# EAGLE design fun_shield_v11 (EAGLE 6.3)
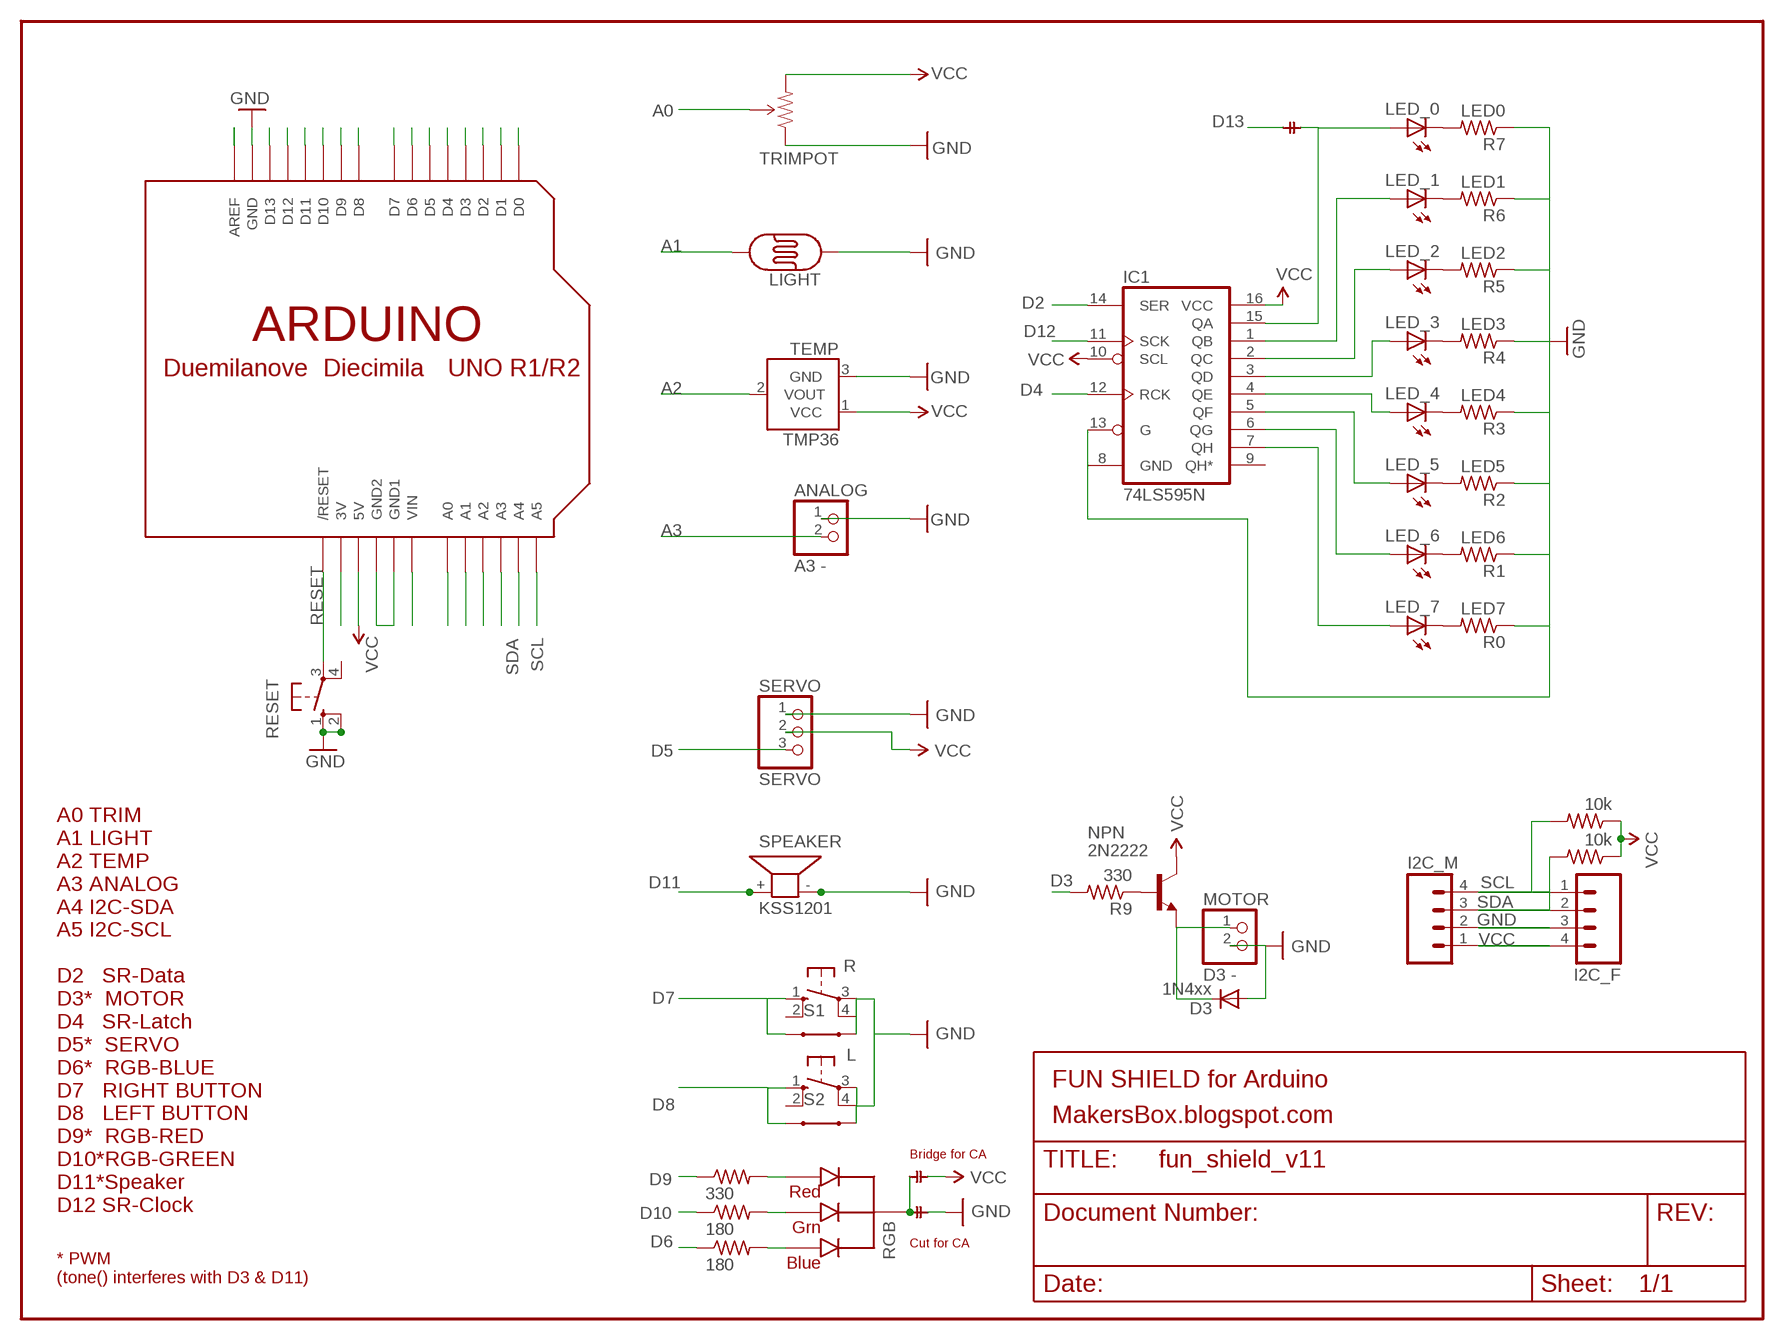
[diagram p0: schematic, sheet 1]

## Parts
ANALOG  A3 -  PINHD-1X2  [1X02]
D3  1N4xx  DIODE1N4148  [DIODE-1N4148]
I2C_F  M04PTH  [1X04]
I2C_M  M04PTH  [1X04]
IC1  74LS595N  [DIL16]
L  10-XX  [B3F-10XX]
LED_0  LED5MM  [LED5MM]
LED_1  LED5MM  [LED5MM]
LED_2  LED5MM  [LED5MM]
LED_3  LED5MM  [LED5MM]
LED_4  LED5MM  [LED5MM]
LED_5  LED5MM  [LED5MM]
LED_6  LED5MM  [LED5MM]
LED_7  LED5MM  [LED5MM]
LIGHT  PHOTOCELLPTH  [PHOTOCELL]
MOTOR  D3 -  PINHD-1X2  [1X02]
NPN  2N2222  [TO92-EBC-OVAL]
R  10-XX  [B3F-10XX]
R0  LED7  R-US_0204/7  [0204/7]
R1  LED6  R-US_0204/7  [0204/7]
R2  LED5  R-US_0204/7  [0204/7]
R3  LED4  R-US_0204/7  [0204/7]
R4  LED3  R-US_0204/7  [0204/7]
R5  LED2  R-US_0204/7  [0204/7]
R6  LED1  R-US_0204/7  [0204/7]
R7  LED0  R-US_0204/7  [0204/7]
R8  330  R-US_0204/7  [0204/7]
R9  330  R-US_0204/7  [0204/7]
R11  180  R-US_0204/7  [0204/7]
R12  180  R-US_0204/7  [0204/7]
R16  10k  R-US_0204/7  [0204/7]
R17  10k  R-US_0204/7  [0204/7]
RESET  10-XX  [B3F-10XX]
RGB  RGBLED_CC  [LED5MMRGB]
S1  SWITCH-MOMENTARY-2-CLOSED  [TACTILE-PTH-12MM]
S2  SWITCH-MOMENTARY-2-CLOSED  [TACTILE-PTH-12MM]
SERVO  SERVO  PINHD-1X3  [1X03]
SP1  KSS1201  [KSS1201]
SPEAKER  SPEAKER/PS12  [PS12]
TMP36  TEMP  TMP36  [TO-92-AMMO]
TRIMPOT  TRIMPOT  [3362U]
U$1  CUT  [CUT]
U$2  CUT_NOT  [CUT_NOT]
U$3  CUT_NOT  [CUT_NOT]
U$5  ARDUINO-NOHOLE  [ARDUINO-NOHOLE]

## Nets
A0: TRIMPOT.P$2(WIPER) TRIMPOT.P$4(WIPER) U$5.A0
A1: LIGHT.2 U$5.A1
A2: TMP36.2(VOUT) U$5.A2
A3: ANALOG.2 U$5.A3
BLUE: R12.2 RGB.4(BLUE)
D0: U$5.D0
D1: U$5.D1
D2: IC1.14(SER) U$5.D2
D3: R9.2 U$5.D3
D4: IC1.12(RCK) U$5.D4
D5: SERVO.3 U$5.D5
D6: R12.1 U$5.D6
D7: R.1(S) S1.1 U$5.D7
D8: L.1(S) S2.1 U$5.D8
D9: R8.1 U$5.D9
D10: R11.1 U$5.D10
D11: SP1.+ SPEAKER.P$1(+) U$5.D11
D12: IC1.11(SCK) U$5.D12
D13: IC1.15(QA) LED_0.A U$3.P$1 U$3.P$2 U$5.D13
GND [power]: ANALOG.1 D3.A I2C_F.3 I2C_M.2 IC1.8(GND) IC1.13(G) L.3(P) L.4(P1) LIGHT.1 MOTOR.2 R0.1 R1.1 R2.1 R3.1 R4.1 R5.1 R6.1 R7.1 R.3(P) R.4(P1) RESET.1(S) RESET.2(S1) S1.3 S2.3 SERVO.1 SP1.- SPEAKER.P$2(-) TMP36.3(GND) TRIMPOT.P$1(CCW) U$2.P$2 U$5.GND U$5.GND1 U$5.GND2
GRN: R11.2 RGB.3(GREEN)
N$1: LED_6.K(C) R1.2
N$2: LED_5.K(C) R2.2
N$3: LED_4.K(C) R3.2
N$4: LED_3.K(C) R4.2
N$5: LED_2.K(C) R5.2
N$6: LED_1.K(C) R6.2
N$7: LED_0.K(C) R7.2
N$8: LED_7.K(C) R0.2
N$10: IC1.1(QB) LED_1.A
N$11: IC1.2(QC) LED_2.A
N$12: IC1.3(QD) LED_3.A
N$13: IC1.4(QE) LED_4.A
N$14: IC1.5(QF) LED_5.A
N$15: IC1.6(QG) LED_6.A
N$16: IC1.7(QH) LED_7.A
N$17: U$5.3V
N$20: D3.C MOTOR.1 NPN.E
N$21: RGB.2(GND) U$1.P$1 U$2.P$1
N$22: NPN.B R9.1
RED: R8.2 RGB.1(RED)
RESET: RESET.3(P) U$5.RESET(/RESET)
SCL: I2C_F.1 I2C_M.4 R17.2 U$5.A5
SDA: I2C_F.2 I2C_M.3 R16.2 U$5.A4
VCC: I2C_F.4 I2C_M.1 IC1.10(SCL) IC1.16(VCC) NPN.C R16.1 R17.1 SERVO.2 TMP36.1(VCC) TRIMPOT.P$3(CW) U$1.P$2 U$5.5V U$5.AREF
VIN: U$5.VIN
Unconnected: IC1.9(QH*) L.2(S1) R.2(S1) RESET.4(P1)

## Notes on the sheet
- FUN SHIELD for Arduino
- MakersBox.blogspot.com
- Bridge for CA
- A0 TRIM
  A1 LIGHT
  A2 TEMP
  A3 ANALOG
  A4 I2C-SDA
  A5 I2C-SCL
  
  D2   SR-Data
  D3*  MOTOR
  D4   SR-Latch
  D5*  SERVO
  D6*  RGB-BLUE
  D7   RIGHT BUTTON
  D8   LEFT BUTTON
  D9*  RGB-RED
  D10*RGB-GREEN
  D11*Speaker
  D12 SR-Clock
- Cut for CA
- * PWM
  (tone() interferes with D3 & D11)

## Library data of the parts
ANALOG MOTOR = pinhead:PINHD-1X2: PIN HEADER
D3 = SparkFun_mod:DIODE: Diode These are standard reverse protection diodes and small signal diodes. SMA package can handle up to about 1A. SOD-323 can handle about 200mA. What the SOD-323 package when ordering, there are some mfgs out there that are 5-pin packages.
I2C_F I2C_M = SparkFun:M04: Header 4 Standard 4-pin 0.1" header. Use with straight break away headers (SKU : PRT-00116), right angle break away headers (PRT-00553), swiss pins (PRT-00743), machine pins (PRT-00117), and female headers (PRT-00115). Molex polarized connector foot print use with SKU : PRT-08231 with associated crimp pins and housings. 1MM SMD Version SKU: PRT-10208
IC1 = SparkFun_mod:74*595: 8-bit SHIFT REGISTER, output latch
L R RESET = switch-omron:10-XX: OMRON SWITCH
LED_0 LED_1-LED_7 = adafruit_mod:LED: LED OSRAM: - CHIPLED LG R971, LG N971, LY N971, LG Q971, LY Q971, LO R971, LY R971 LH N974, LH R974 LS Q976, LO Q976, LY Q976 LO Q996 - Hyper CHIPLED LW Q18S LB Q993, LB Q99A, LB R99A - SideLED LS A670, LO A670, LY A670, LG A670, LP A670 LB A673, LV A673, LT A673, LW A673 LH A674 LY A675 LS A676, LA A676, LO A676, LY A676, LW A676 LS A679, LY A679, LG A679 - Hyper Micro SIDELED® LS Y876, LA Y876, LO Y876, LY Y876 LT Y87S - SmartLED LW L88C, LW L88S LB L89C, LB L89S, LG L890 LS L89K, LO L89K, LY L89K LS L896, LA L896, LO L896, LY L896 - TOPLED LS T670, LO T670, LY T670, LG T670, LP T670 LSG T670, LSP T670, LSY T670, LOP T670, LYG T670 LG T671, LOG T671, LSG T671 LB T673, LV T673, LT T673, LW T673 LH T674 LS T676, LA T676, LO T676, LY T676, LB T676, LH T676, LSB T676, LW T676 LB T67C, LV T67C, LT T67C, LS T67K, LO T67K, LY T67K, LW E67C LS E67B, LA E67B, LO E67B, LY E67B, LB E67C, LV E67C, LT E67C LW T67C LS T679, LY T679, LG T679 LS T770, LO T770, LY T770, LG T770, LP T770 LB T773, LV T773, LT T773, LW T773 LH T774 LS E675, LA E675, LY E675, LS T675 LS T776, LA T776, LO T776, LY T776, LB T776 LHGB T686 LT T68C, LB T68C - Hyper Mini TOPLED® LB M676 - Mini TOPLED Santana® LG M470 LS M47K, LO M47K, LY M47K Source: http://www.osram.convergy.de/
LIGHT = SparkFun_mod:PHOTOCELL: Photocell Also known as a CdS photoresistor. This is a low cost way to detect light levels. Resistance decreases with more incoming light. SparkFun SKU: SEN-09088
NPN = adafruit_mod:2N2222: NPN TRANSISTOR Big oval pads
R0 R1-R9 R11 R12 R16 R17 = adafruit_mod:R-US_: RESISTOR, American symbol
RGB = adafruit_mod:RGBLED_CC
S1 S2 = SparkFun-Electromechanical:SWITCH-MOMENTARY-2-CLOSED: Closed Switch for tutorial schematics. Not intended for PCB design. Maps to 12mm tact switch, only because eagle won't place a part with no package defined. The ordinary SWITCH-MOMENTARY-2 is likely to be more useful for regular schematics.
SERVO = pinhead:PINHD-1X3: PIN HEADER
SP1 = buzzer:KSS1201: SPEAKER Source: Schukat; OC_FARNELL: unknown; OC_NEWARK: unknown
SPEAKER = adafruit_mod:SPEAKER: SPEAKER Source: Buerklin Added PS12 (for part # PS1240 piezo) http://www.ladyada.net/library/pcb/eaglelibrary.html
TMP36 = SparkFun_mod:TMP36
TRIMPOT = SparkFun_mod:TRIMPOT
U$1 = _my-parts_level22:CUT
U$2 U$3 = _my-parts_level22:CUT_NOT
U$5 = adafruit_mod:ARDUINO: Arduino Diecimila/Duemilanove Make a shield with ease, this package has all the named pins as well as the two mounting drill holes and an outline of the USB and DC power connector. The outline is on the DIMENSION layer, so if your board house uses it they will cut the outline to match. http://www.ladyada.net/library/pcb/eaglelibrary.html

## Net classes
1 power: width 0.61 mm

## Board
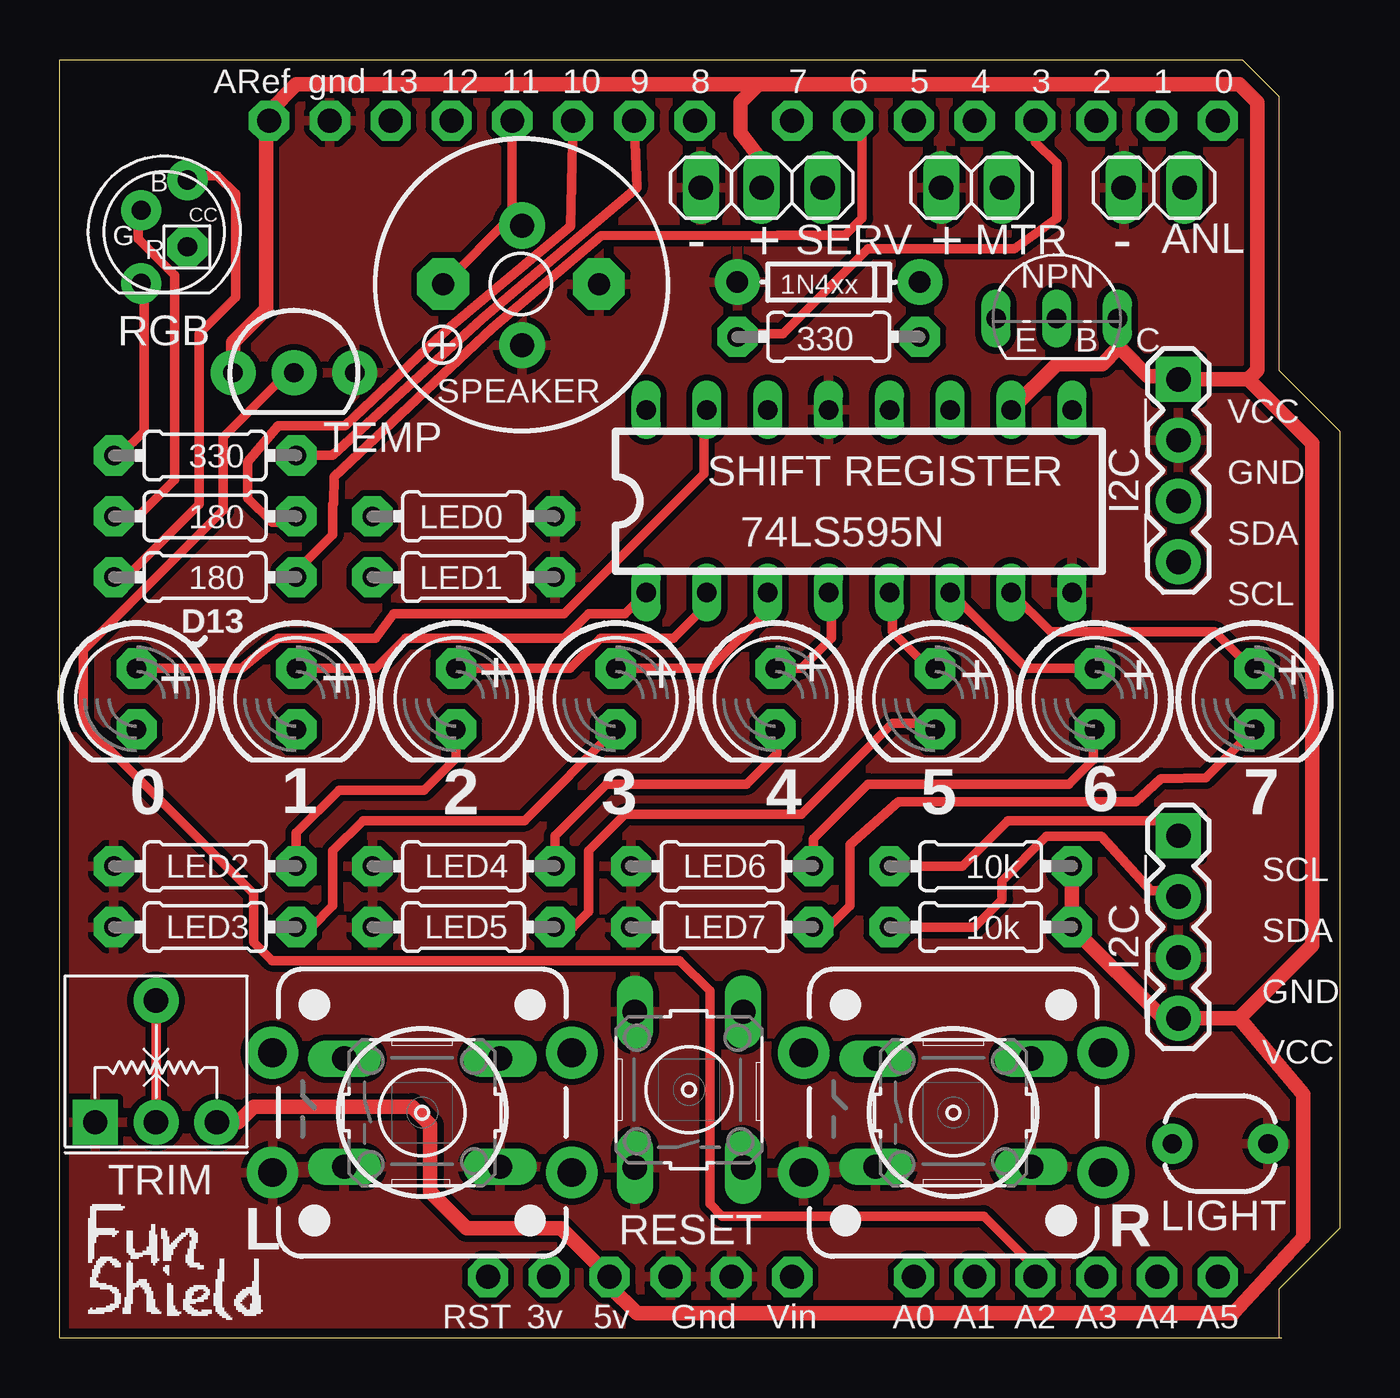
[diagram p1: board, top side]
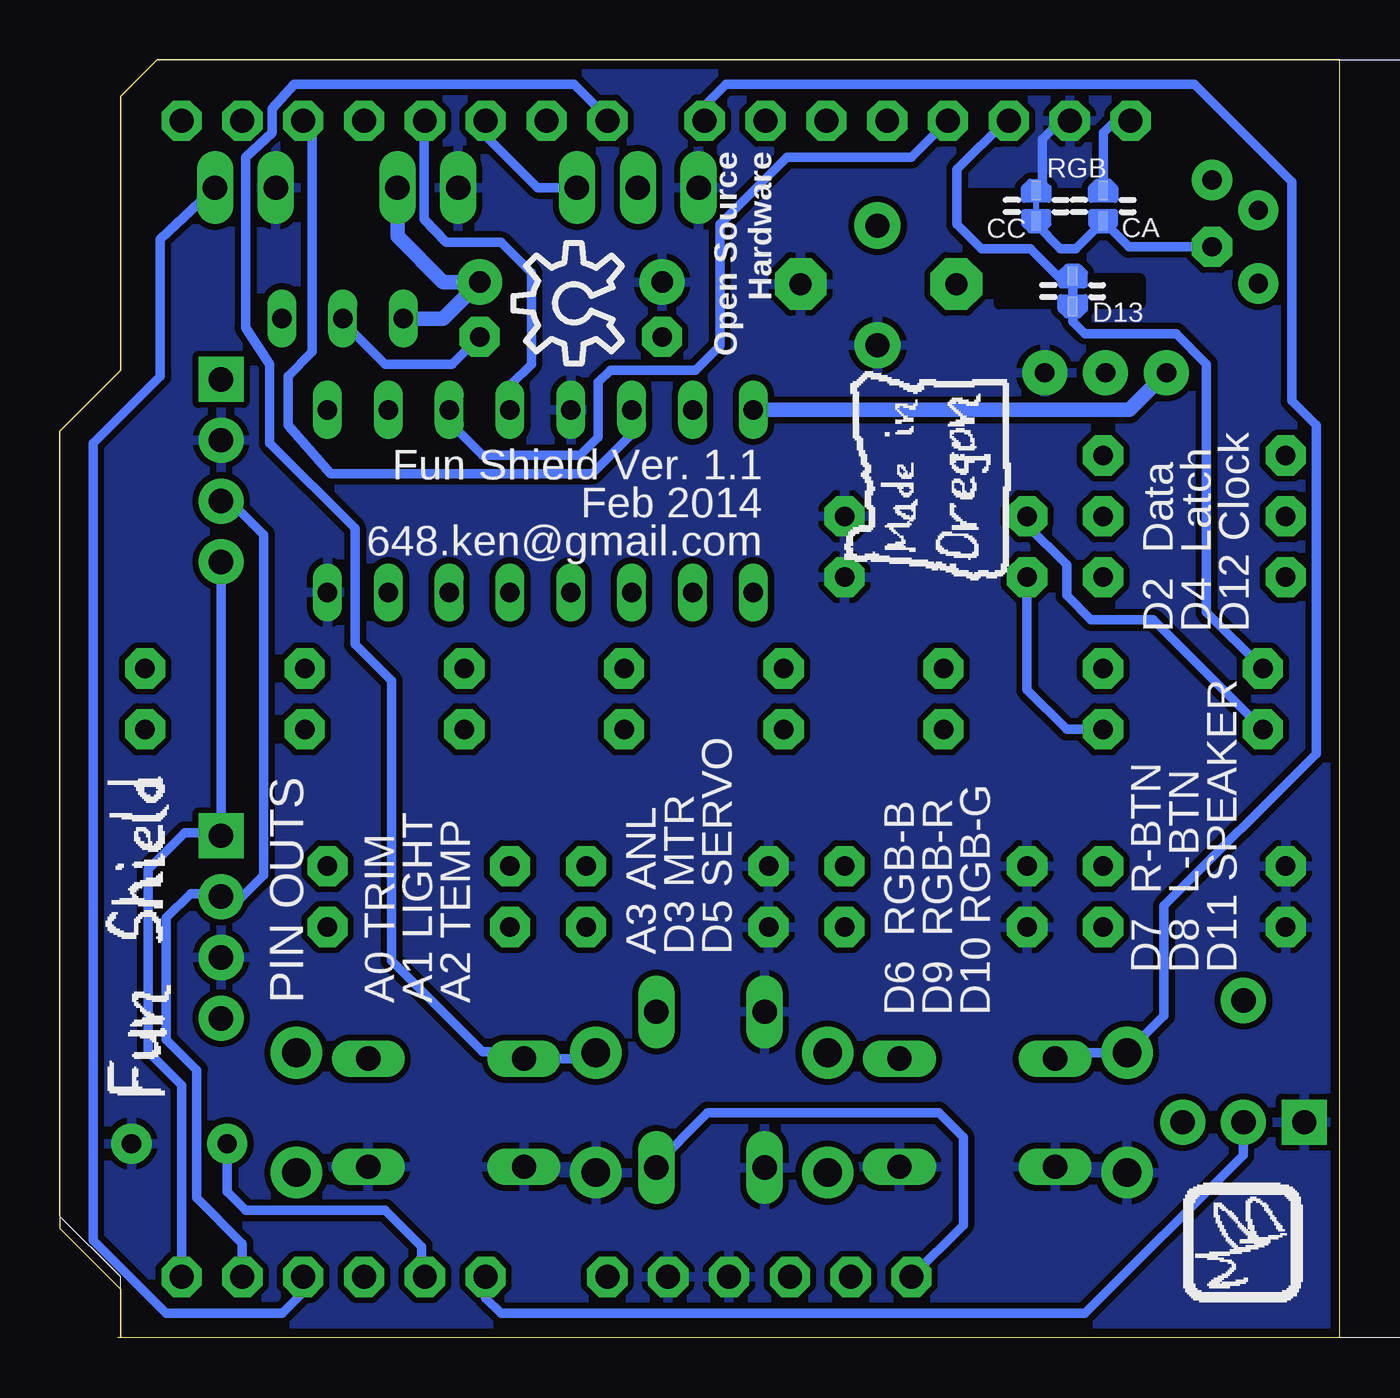
[diagram p2: board, bottom side, seen from below]

Size 53.44 x 53.34 mm. Coordinates in mm from the lower left corner, seen from the top.
Outline: 50.9,0 50.9,2.03 53.44,4.57 53.44,37.85 50.9,40.39 50.9,51.82 49.37,53.34 0,53.34 0,0 51.02,0
Copper layers (1*16): Top 0.0356mm / dielectric 1.5011mm / Bottom 0.0356mm
Design rules "LaenPCBOrder": minimum track width 6mil, minimum drill 13mil, track to track 6mil, track to pad 6mil, pad to pad 6mil, via to via 6mil, smd to smd 6mil, copper to edge 15mil, drill to drill 6mil, minimum pad ring 7mil, minimum via ring 7mil, stop-mask expansion 4mil, vias tented up to drill 0mil, thermal gap 10mil

### Footprints (pad centres in the part's own frame; a part is rotated, then mirrored left to right if it is on the bottom)
1X02 = drill 1.016 long: 1 -1.27,0; 2 1.27,0
DIODE-1N4148 = drill 0.9 pad 1.88: A -3.81,0; C 3.81,0
1X04 = drill 1.016 pad 1.88 square: 1 0,0 | drill 1.016 pad 1.88: 2 2.54,0; 3 5.08,0; 4 7.62,0
DIL16 = drill 0.813 long: 1 -8.89,-3.81; 2 -6.35,-3.81; 3 -3.81,-3.81; 4 -1.27,-3.81; 5 1.27,-3.81; 6 3.81,-3.81; 7 6.35,-3.81; 8 8.89,-3.81; 9 8.89,3.81; 10 6.35,3.81; 11 3.81,3.81; 12 1.27,3.81; 13 -1.27,3.81; 14 -3.81,3.81; 15 -6.35,3.81; 16 -8.89,3.81
B3F-10XX = drill 1.016 long: 1 -3.251,2.261; 2 3.251,2.261; 3 -3.251,-2.261; 4 3.251,-2.261
LED5MM = drill 0.813 pad 1.676 octagon: A -1.27,0; K 1.27,0
PHOTOCELL = drill 0.8 pad 1.676: 1 -2,0; 2 2,0
TO92-EBC-OVAL = drill 0.813 long: B 0,-1.27; C 2.54,-1.27; E -2.54,-1.27
0204/7 = drill 0.813 pad 1.676 octagon: 1 -3.81,0; 2 3.81,0
LED5MMRGB = drill 0.8 pad 1.676: 1 -2.159,0.968; 3 0.889,0.968; 4 2.159,-0.968 | drill 0.8 pad 1.676 octagon: 2 -0.635,-0.968
TACTILE-PTH-12MM = drill 1.2 pad 2.159: 1 6.25,-2.5; 2 -6.25,-2.5; 3 6.25,2.5; 4 -6.25,2.5
1X03 = drill 1.016 long: 1 -2.54,0; 2 0,0; 3 2.54,0
KSS1201 = drill 0.914 pad 2.159 octagon: + 3.251,0; - -3.251,0
PS12 = drill 1 pad 1.93: P$1 -2.5,0; P$2 2.5,0
TO-92-AMMO = drill 0.813 pad 1.88: 1 -2.54,0; 2 0,0; 3 2.54,0
3362U = drill 1.016 pad 1.88 square: P$1 0,0 | drill 1.016 pad 1.88: P$2 2.54,0; P$3 5.08,0; P$4 2.54,5.08
CUT = smd 0.813 x 0.406 bottom: P$1 -0.635,0; P$2 0.635,0
CUT_NOT = smd 0.813 x 0.406 bottom: P$1 -0.635,0; P$2 0.635,0
ARDUINO-NOHOLE = drill 1 pad 1.676 octagon: 3V 35.56,2.54; 5V 38.1,2.54; A0 50.8,2.54; A1 53.34,2.54; A2 55.88,2.54; A3 58.42,2.54; A4 60.96,2.54; A5 63.5,2.54; AREF 23.876,50.8; D0 63.5,50.8; D1 60.96,50.8; D2 58.42,50.8; D3 55.88,50.8; D4 53.34,50.8; D5 50.8,50.8; D6 48.26,50.8; D7 45.72,50.8; D8 41.656,50.8; D9 39.116,50.8; D10 36.576,50.8; D11 34.036,50.8; D12 31.496,50.8; D13 28.956,50.8; GND 26.416,50.8; GND1 43.18,2.54; GND2 40.64,2.54; RESET 33.02,2.54; VIN 45.72,2.54

### Placement (x,y rotation side)
ANALOG  45.69,48.01 0 top
D3  32.1,44.07 0 top
I2C_F  46.7,20.95 270 top
I2C_M  46.7,40.01 270 top
IC1  33.37,34.92 0 top
L  15.13,9.4 0 top
LED_0  3.21,26.67 270 top
LED_1  9.87,26.67 270 top
LED_2  16.54,26.67 270 top
LED_3  23.21,26.67 270 top
LED_4  29.88,26.67 270 top
LED_5  36.54,26.67 270 top
LED_6  43.21,26.67 270 top
LED_7  49.88,26.67 270 top
LIGHT  48.45,8.11 180 top
MOTOR  38.07,48.01 180 top
NPN  41.62,43.81 0 top
R  37.31,9.4 0 top
R0  27.65,17.14 0 top
R1  27.65,19.68 0 top
R2  16.86,17.14 0 top
R3  16.86,19.68 0 top
R4  6.06,17.14 0 top
R5  6.06,19.68 0 top
R6  16.86,31.75 180 top
R7  16.86,34.29 180 top
R8  6.06,36.83 180 top
R9  32.1,41.78 180 top
R11  6.06,34.29 180 top
R12  6.06,31.75 180 top
R16  38.45,17.14 180 top
R17  38.45,19.68 180 top
RESET  26.27,10.36 90 top
RGB  4.36,46.17 90 top
S1  37.31,9.4 180 top
S2  15.13,9.4 180 top
SERVO  29.31,48.01 0 top
SP1  19.25,43.98 180 top
SPEAKER  19.29,43.92 270 top
TMP36  9.77,40.28 0 top
TRIMPOT  1.47,9 0 top
U$1  9.87,47.24 90 top
U$2  12.67,47.24 90 top
U$3  11.14,43.69 270 top
U$4  [FUN_SHEILD_22]  49.96,8.99 270 top
U$5  -15.14,0 0 top
U$6  [MB_02_22]  1.75,6.18 270 top
U$7  [OREGON_REV_035]  13.68,40.39 270 top
U$8  [FUN_SHIELD_03_300]  1.14,0.71 0 top
U$9  [OSHWLOGO_BOTTOM]  31.97,43.18 270 top

### Tracks (layer width: path | path; a pad name or v marks a point on that pad's centre or on a via)
A0
  Bottom 0.406: U$5.A0 35.66,1.65 35.02,1.02 10.64,1.02 4.03,7.62 4.03,8.98 TRIMPOT.P$2
A1
  Bottom 0.406: LIGHT.2 46.44,6.09 45.69,5.33 39.85,5.33 38.32,3.81 38.32,2.67 U$5.A1
A2
  Top 0.406: TMP36.2 9.52,40.28 6.83,37.59 6.83,34.54 0.98,28.7 0.98,25.65 8.1,18.54 8.1,16.51 8.86,15.75 25.88,15.75 27.15,14.48 27.15,5.59 27.65,5.08 38.58,5.08 40.61,3.05 40.61,2.67 U$5.A2
A3
  Bottom 0.406: U$5.A3 43.28,1.91 44.16,1.02 48.99,1.02 52.04,4.06 52.04,37.34 49.24,40.13 49.24,45.85 ANALOG.2
BLUE
  Top 0.406: R12.2 2.76,31.75 5.81,34.8 5.81,41.91 7.33,43.43 7.33,47.75 6.57,48.51 5.51,48.51 RGB.4
D2
  Bottom 0.406: IC1.14 29.56,37.72 31.21,36.07 42.13,36.07 43.91,38.1 43.91,40.13 42.89,41.15 42.89,50.42 U$5.D2
D3
  Top 0.406: U$5.D3 40.73,49.91 41.62,49.02 41.62,46.74 39.85,45.47 33.75,45.47 30.19,41.91 28.42,41.91 R9.2
D4
  Bottom 0.406: IC1.12 34.64,39.75 33.75,40.64 33.75,44.45 35.02,45.72 37.31,45.72 38.22,46.69 38.22,50.62 U$5.D4
D5
  Bottom 0.406: U$5.D5 35.66,50.16 33.5,48.01 SERVO.3
D6
  Top 0.406: R12.1 9.87,32 11.4,33.53 11.4,34.8 11.42,34.82 11.45,35.94 18.05,42.14 22.6,46 29.96,46.02 32.78,46.02 33.5,46.74 33.5,50.42 U$5.D6
D7
  Bottom 0.406: U$5.D7 30.57,50.93 31.97,52.32 43.66,52.32 44.57,51.31 44.57,50.29 45.69,49.28 45.69,42.16 44.67,40.64 44.67,37.34 41.12,33.78 41.12,28.96 39.59,27.43 39.59,15.75 35.78,11.94 34.33,11.94 R.1 31.29,11.66 S1.1
D8
  Bottom 0.406: U$5.D8 26.51,51.44 25.62,52.32 6.06,52.32 2,48.26 2,39.12 0.98,38.1 0.98,24.38 7.33,18.03 7.33,13.44 S2.1 11.64,11.9 L.1
D9
  Top 0.406: U$5.D9 24.1,48.01 17.62,42.55 11.4,36.83 R8.1
D10
  Top 0.406: U$5.D10 21.33,46.41 16.35,42.24 15.72,41.66 11.91,38.08 9.11,38.08 7.84,36.58 7.84,35.05 8.86,34.04 9.62,34.04 R11.1
D11
  Top 0.406: U$5.D11 18.89,46.83 | 18.89,46.83 SPEAKER.P$1 | SP1.+ 16.05,43.98 18.89,46.83
D12
  Bottom 0.406: IC1.11 37.18,38.23 35.78,36.83 31.72,36.83 30.96,37.59 30.96,39.88 30.45,40.39 26.89,40.39 25.88,41.4 25.88,46.48 23.08,49.28 17.88,49.28 U$5.D12
D13
  Top 0.406: LED_0.A 7.59,27.94 9.11,29.21 13.18,29.21 13.94,30.23 21.05,30.23 26.89,36.07 26.89,38.61 IC1.15
  Bottom 0.406: U$5.D13 13.94,50.8 15.97,48.77 15.97,46.48 14.95,45.47 12.92,45.47 11.65,44.2 11.27,44.2 U$3.P$1 U$3.P$2 11.14,42.42 10.64,41.91 6.83,41.91 5.56,40.64 5.56,30.29 LED_0.A
GND
  Bottom 0.406: U$5.GND 11.65,50.8 12.41,50.04 12.41,48.13 U$2.P$2
  pour Bottom (isolate 0.254): -17.68,58.42 57.88,57.78 57.88,-3.05 -17.68,-3.81
  pour Top (isolate 0.254): -18.95,57.15 60.17,56.9 59.91,-4.83 -17.68,-4.83
GRN
  Top 0.406: R11.2 3.27,34.29 4.79,35.81 4.79,44.35 3.27,45.87 3.27,46.94 RGB.3
N$1
  Top 0.406: R1.2 31.46,20.83 33.75,23.11 42.13,23.11 43.15,24.13 43.15,25.34 LED_6.K
N$2
  Top 0.406: R2.2 21.43,17.14 22.07,17.78 22.07,20.32 23.59,21.84 30.96,21.84 34.77,25.65 36.29,25.65 LED_5.K
N$3
  Top 0.406: R3.2 20.67,20.95 22.83,23.11 28.67,23.11 29.94,24.38 29.94,25.34 LED_4.K
N$4
  Top 0.406: R4.2 10.51,17.14 11.4,18.03 11.4,20.32 12.67,21.59 19.4,21.59 LED_3.K
N$5
  Top 0.406: LED_2.K 16.54,24.19 15.21,22.86 11.65,22.86 9.87,21.08 R5.2
N$6
  Bottom 0.406: R6.2 13.05,27.05 11.4,25.4 LED_1.K
N$7
  Bottom 0.406: R7.2 13.05,33.91 11.4,32.26 11.4,30.99 10.38,29.97 7.78,29.97 LED_0.K
N$8
  Top 0.406: R0.2 32.1,17.14 32.99,18.03 32.99,20.57 35.02,22.38 44.93,22.38 45.97,23.34 47.85,23.37 LED_7.K
N$10
  Top 0.406: LED_1.A 13.18,27.94 14.45,29.21 21.05,29.21 22.07,30.23 23.59,30.23 IC1.1
N$11
  Top 0.406: LED_2.A 21.3,27.94 22.57,29.21 25.62,29.21 26.89,30.48 26.89,30.99 IC1.2
N$12
  Top 0.406: LED_3.A 27.15,27.94 29.69,30.48 29.69,30.99 IC1.3
N$13
  Top 0.406: LED_4.A 30.96,27.94 32.23,29.21 32.23,30.99 IC1.4
N$14
  Top 0.406: LED_5.A 36.29,27.94 34.77,29.46 34.77,30.99 IC1.5
N$15
  Top 0.406: LED_6.A 40.35,27.94 IC1.6
N$16
  Top 0.406: LED_7.A 49.75,27.94 48.23,29.46 41.37,29.46 IC1.7
N$20
  Bottom 0.61: MOTOR.1 39.34,45.97 37.43,44.07 D3.C 37.43,42.55 NPN.E
N$21
  Bottom 0.406: RGB.2 8.8,45.53 U$1.P$1 11.02,45.47 11.65,45.47 12.67,46.48 U$2.P$1
N$22
  Bottom 0.406: NPN.B 41.62,42.42 39.85,40.64 37.05,40.64 R9.1
RED
  Top 0.406: R8.2 2.51,36.83 3.52,37.85 3.52,43.88 RGB.1
RESET
  Bottom 0.406: RESET.3 28.68,7.11 26.38,9.4 16.73,9.4 15.72,8.38 15.72,4.7 U$5.RESET
SCL
  Top 0.406: R17.2 37.69,19.68 39.59,21.59 46.07,21.59 I2C_F.1
  Bottom 0.406: U$5.A5 48.36,10.54 49.75,11.94 49.75,19.56 48.23,21.08 46.83,21.08 I2C_F.1 I2C_M.4
SDA
  Top 0.406: R16.2 38.19,17.14 39.34,18.29 39.34,19.05 41.19,20.93 43.48,20.93 45.56,18.67 45.81,18.67 46.2,18.29 46.58,18.29 I2C_F.2
  Bottom 0.406: I2C_M.3 46.32,34.92 44.93,33.53 44.93,19.3 45.94,18.29 46.58,18.29 I2C_F.2 46.83,18.54 47.97,18.54 48.99,17.53 48.99,12.45 47.72,11.18 47.72,5.84 45.81,3.94 U$5.A4
VCC
  Top 0.61: 49.24,13.34 51.91,10.16 51.91,4.19 48.99,1.02 24.1,1.02 22.96,2.16 U$5.5V 20.92,4.57 16.99,4.57 15.46,6.1 15.46,8.89 14.7,9.65 8.1,9.65 7.44,9 TRIMPOT.P$3 | 49.24,13.34 I2C_F.4 46.07,13.34 R16.1 R17.1 | 44.16,41.27 43.53,40.64 41.62,40.64 IC1.10 39.72,39.24 | 44.16,41.27 NPN.C | TMP36.1 7.23,41.56 8.6,42.93 8.6,50.67 U$5.AREF 8.73,51.18 9.87,52.32 29.18,52.32 | 49.62,40.01 I2C_M.1 46.58,40.13 45.43,40.13 44.29,41.27 44.16,41.27 | 49.62,40.01 52.29,37.34 52.29,16.38 49.24,13.34 | SERVO.2 29.31,49.15 28.42,50.29 28.42,51.56 29.18,52.32 | 29.18,52.32 49.24,52.32 50.01,51.56 50.01,40.39 49.62,40.01
  Bottom 0.406: U$1.P$2 9.87,50.29 8.86,51.31 8.86,50.93 U$5.AREF
  Bottom 0.61: IC1.16 8.78,38.73 TMP36.1

### Text on the board
tPlace: B | CC | G | G | R | - | + | SERV | + | MTR | - | ANL | 330 | E | B | C | TEMP | SHIFT REGISTER | __I2C__ | VCC / / GND / / SDA / / SCL | D13 | + | + | + | + | + | + | + | + | 0 | 1 | 2 | 3 | 4 | 5 | 6 | 7 | __I2C__ | SCL / / SDA / / GND / / VCC | TRIM
bPlace: Open Source / Hardware | RGB | CA | CC | D13 | Fun Shield Ver. 1.1 / Feb 2014 / 648.ken@gmail.com | D2 Data / D4 Latch / D12 Clock | A3 ANL / D3 MTR / D5 SERVO | D7 R-BTN / D8 L-BTN / D11 SPEAKER | A0 TRIM / A1 LIGHT / A2 TEMP | PIN OUTS | D6 RGB-B / D9 RGB-R / D10 RGB-G